# Altium schematic sheet MCU.SchDoc
size A4
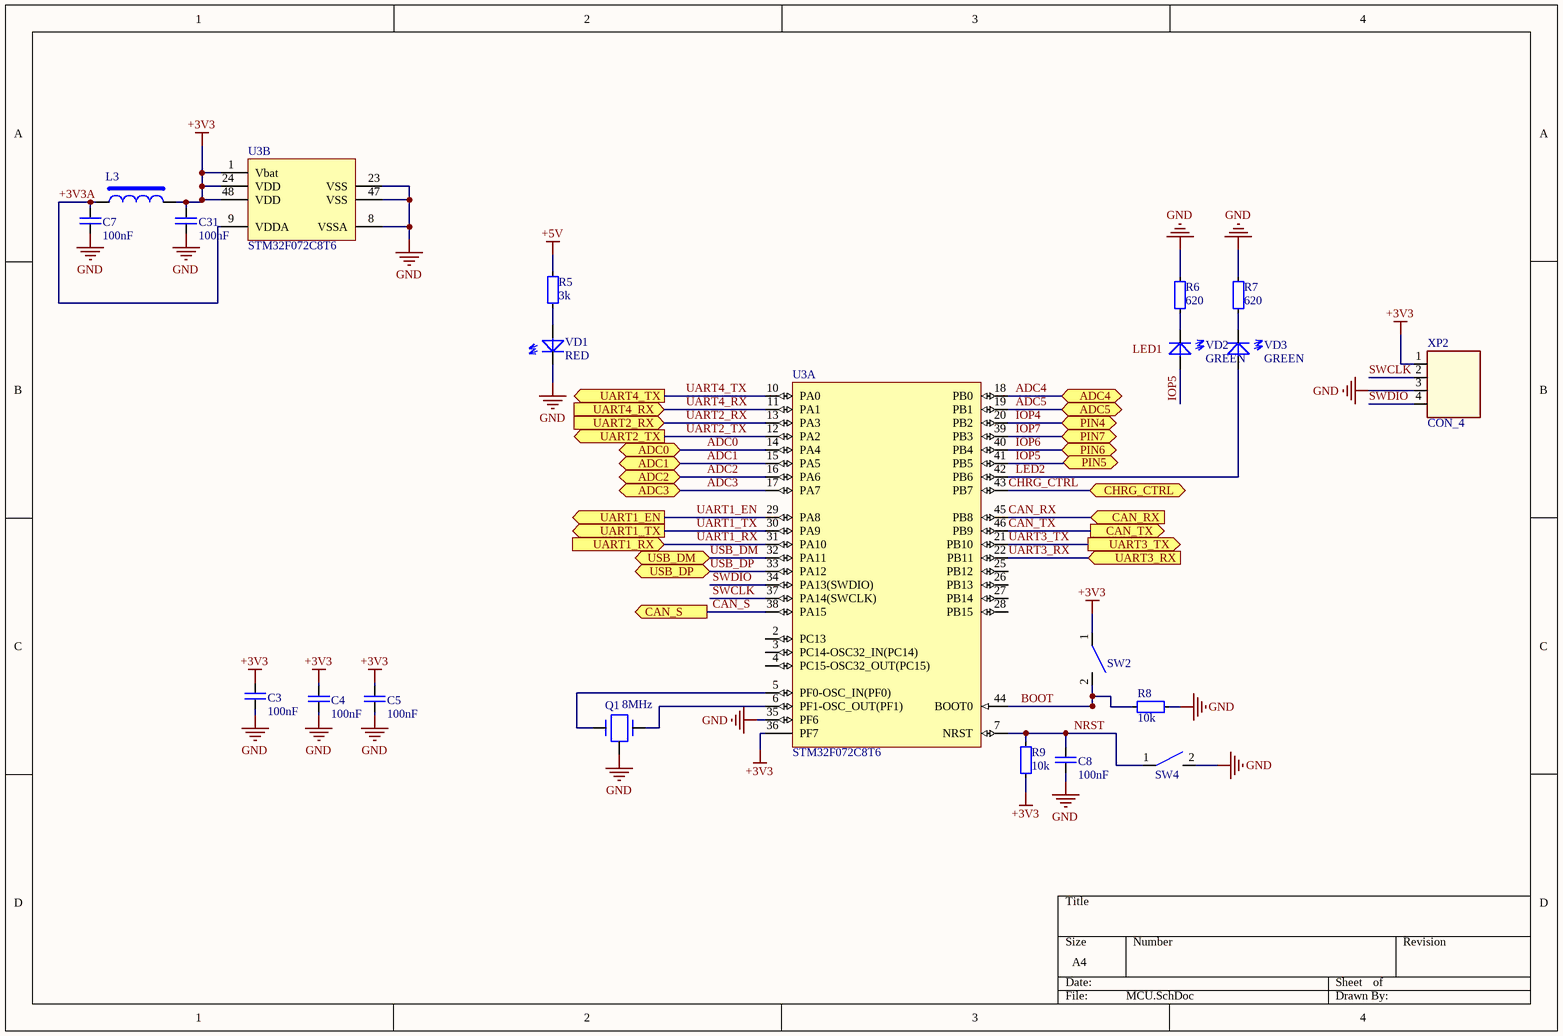
[diagram p0: MCU.SchDoc]

## Parts
C3  100nF  [SMD_0805]
C4  100nF  [SMD_0805]
C5  100nF  [SMD_0805]
C7  100nF  [SMD_0805]
C8  100nF  [SMD_0805]
C31  100nF  [SMD_0805]
L3  (no value)  [INDC4516AM]
Q1  8MHz  [CSTCC-CRYSTAL]
R5  3k  [SMD_0805]
R6  620  [SMD_0805]
R7  620  [SMD_0805]
R8  10k  [SMD_0805]
R9  10k  [SMD_0805]
SW2  SW  [SW_6/3.7]  (value not drawn)
SW4  SW  [SW_6/3.7]  (value not drawn)
U3  STM32F072C8T6  [STM-LQFP48_L]  (parts A,B of 2)
VD1  RED  [SMD_0805]
VD2  GREEN  [SMD_0805]
VD3  GREEN  [SMD_0805]
XP2  CON_4  [HEAD-1/4/2.54]

## Ports
ADC0, ADC1, ADC2, ADC3, ADC4, ADC5, CAN_RX (in), CAN_S (out), CAN_TX (out), CHRG_CTRL, PIN4, PIN5, PIN6, PIN7, UART1_EN (out), UART1_RX (in), UART1_TX (out), UART2_RX (in), UART2_TX (out), UART3_RX (in), UART3_TX (out), UART4_RX (in), UART4_TX (out), USB_DM (bidir), USB_DP (bidir)

## Nets
+3V3: C3.1 C4.1 C5.1 C31.1 L3.2 R9.2 SW2.1 U3.1(Vbat) U3.24(VDD) U3.36(PF7) U3.48(VDD) XP2.1
+5V: R5.1
GND: C3.2 C4.2 C5.2 C7.2 C8.2 C31.2 Q1.2 R6.1 R7.1 R8.1 SW4.2 U3.8(VSSA) U3.23(VSS) U3.35(PF6) U3.47(VSS) VD1.1(C) XP2.3
+3V3A: C7.1 L3.1 U3.9(VDDA)
ADC0: U3.14(PA4) ; port ADC0
ADC1: U3.15(PA5) ; port ADC1
ADC2: U3.16(PA6) ; port ADC2
ADC3: U3.17(PA7) ; port ADC3
ADC4: U3.18(PB0) ; port ADC4
ADC5: U3.19(PB1) ; port ADC5
BOOT: R8.2 SW2.2 U3.44(BOOT0)
CAN_RX: U3.45(PB8) ; port CAN_RX
CAN_S: U3.38(PA15) ; port CAN_S
CAN_TX: U3.46(PB9) ; port CAN_TX
CHRG_CTRL: U3.43(PB7) ; port CHRG_CTRL
IOP4: U3.20(PB2) ; port PIN4
IOP5: U3.41(PB5) VD2.2(A) ; port PIN5
IOP6: U3.40(PB4) ; port PIN6
IOP7: U3.39(PB3) ; port PIN7
LED2: U3.42(PB6) VD3.2(A)
NRST: C8.1 R9.1 SW4.1 U3.7(NRST)
SWCLK: U3.37(PA14(SWCLK)) XP2.2
SWDIO: U3.34(PA13(SWDIO)) XP2.4
UART1_EN: U3.29(PA8) ; port UART1_EN
UART1_RX: U3.31(PA10) ; port UART1_RX
UART1_TX: U3.30(PA9) ; port UART1_TX
UART2_RX: U3.13(PA3) ; port UART2_RX
UART2_TX: U3.12(PA2) ; port UART2_TX
UART3_RX: U3.22(PB11) ; port UART3_RX
UART3_TX: U3.21(PB10) ; port UART3_TX
UART4_RX: U3.11(PA1) ; port UART4_RX
UART4_TX: U3.10(PA0) ; port UART4_TX
USB_DM: U3.32(PA11) ; port USB_DM
USB_DP: U3.33(PA12) ; port USB_DP
NetQ1_1: Q1.1 U3.5(PF0-OSC_IN(PF0))
NetQ1_3: Q1.3 U3.6(PF1-OSC_OUT(PF1))
NetR5_2: R5.2 VD1.2(A)
NetR6_2: R6.2 VD2.1(C)
NetR7_2: R7.2 VD3.1(C)

Not connected (* = marked no-connect by the designer): SW2 3 4; SW4 3 4; U3 2(PC13) 3(PC14-OSC32_IN(PC14)) 4(PC15-OSC32_OUT(PC15)) 25(PB12) 26(PB13) 27(PB14) 28(PB15)

## Notes on the sheet
- Labels drawn without touching a wire or pin: LED1

## Library data of the parts
C3-C5 C7 C8 C31 = C_NONE_POLAR: None polar capacitor; Value: 100nF
  C7 C31: Case: 0805
L3 = FB: Ferrite Bread
Q1 = CRYSTAL_CAP: Crystal oscillator; Model: CSTCC8M00G53A-R0; Value: 8MHz
R5-R9 = RES: Resistor
  R5: Value: 3k
  R6 R7: Value: 620
  R8 R9: Value: 10k
SW2 SW4 = SW: Switch
U3 = STM32F072C8T6: ARM Cortex-M0 32-bit MCU, 64 KB Flash, 8 KB Internal RAM, 39 I/Os, 48-pin LQFP, -40 to 85 degC, Tray; PartNumber: STM32F030C8T6; FLASH Size (Prog) (kB): 64; I/Os (High Current): 39; Internal RAM Size (kB): 8; Operating Frequency(F) (Processor speed) (MHz): 48; Supply Voltage(Vcc) min (V): 2.4; DatasheetVersion: Rev. 1; PackageVersion: Rev. 6, 06/2013; PackageReference: LQFP48; PackageDescription: 48-Pin Low Profile Quad Flat Package, 7 x 7 mm Body, 0.5 mm Pitch; Supplier 1: Digi-Key; Supplier Part Number 1: 497-14043-ND; Supplier 2: Newark; Supplier Part Number 2: 06X3647; Supplier 3: Mouser; Supplier Part Number 3: 511-STM32F030C8T6; Core: ARM Cortex-M0; Packing: Tray; Mounting Technology: Surface Mount; ComponentLink1Description: Manufacturer URL; ComponentLink1URL: http://www.st.com/web/en/home.html; ComponentLink2Description: Datasheet; ComponentLink2URL: http://www.st.com/st-web-ui/static/active/en/resource/technical/document/datasheet/DM00088500.pdf; ComponentLink3Description: Package Specification; ComponentLink3URL: http://www.st.com/st-web-ui/static/active/en/resource/technical/document/datasheet/DM00058181.pdf
VD1-VD3 = LED: Value: 0805